# EAGLE design nixieSocket-v1 (EAGLE 5.06)
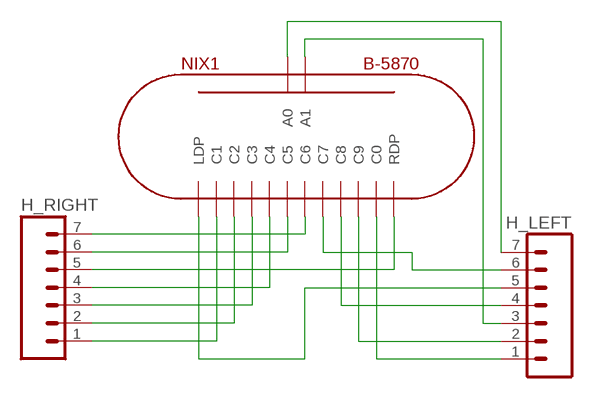
[diagram p0: schematic, sheet 1]

## Parts
H_LEFT  M07  [1X07]
H_RIGHT  M07  [1X07]
NIX1  B-5870  [B-5870]

## Nets
N$1: H_RIGHT.1 NIX1.C1
N$2: H_RIGHT.2 NIX1.C2
N$3: H_RIGHT.3 NIX1.C3
N$4: H_RIGHT.4 NIX1.C4
N$6: H_RIGHT.5 NIX1.RDP
N$7: H_RIGHT.6 NIX1.C5
N$8: H_RIGHT.7 NIX1.C6
N$9: H_LEFT.1 NIX1.C0
N$10: H_LEFT.3 NIX1.A1
N$11: H_LEFT.2 NIX1.C9
N$12: H_LEFT.4 NIX1.C8
N$13: H_LEFT.5 NIX1.LDP
N$14: H_LEFT.6 NIX1.C7
N$15: H_LEFT.7 NIX1.A0

## Library data of the parts
H_LEFT H_RIGHT = SparkFun:M07: Header 7 Standard 7-pin 0.1" header. Use with straight break away headers (SKU : PRT-00116), right angle break away headers (PRT-00553), swiss pins (PRT-00743), machine pins (PRT-00117), and female headers (PRT-00115). NOTES ON THE VARIANTS LOCK and LOCK_LONGPADS... This footprint was designed to help hold the alignment of a through-hole component (i.e. 7-pin header) while soldering it into place. You may notice that each hole has been shifted either up or down by 0.005 of an inch from it's more standard position (which is usually a perfectly straight line). This slight alteration caused the pins (the squares in the middle) to touch the edges of the holes. Because they are alternating, it causes a "brace" to hold the header in place. 0.005 has proven to be the perfect amount of "off-center" position when using our standard breakaway headers. Although looks a little odd when you look at the bare footprint, once you have a header in there, the alteration is very hard to notice. Also, if you push a header all the way into place, it is covered up entirely on the bottom side. This idea of altering the position of holes to aid alignment will be further integrated into the Sparkfun Library for other footprints. It can help hold any component with 3 or more connection pins.
NIX1 = ungood:B-5870: Burroughs 10-digit Nixie tube with left and right decimal points. B-5870S B-5870ST B-5870SF B-5870TF B-5870L

## Board
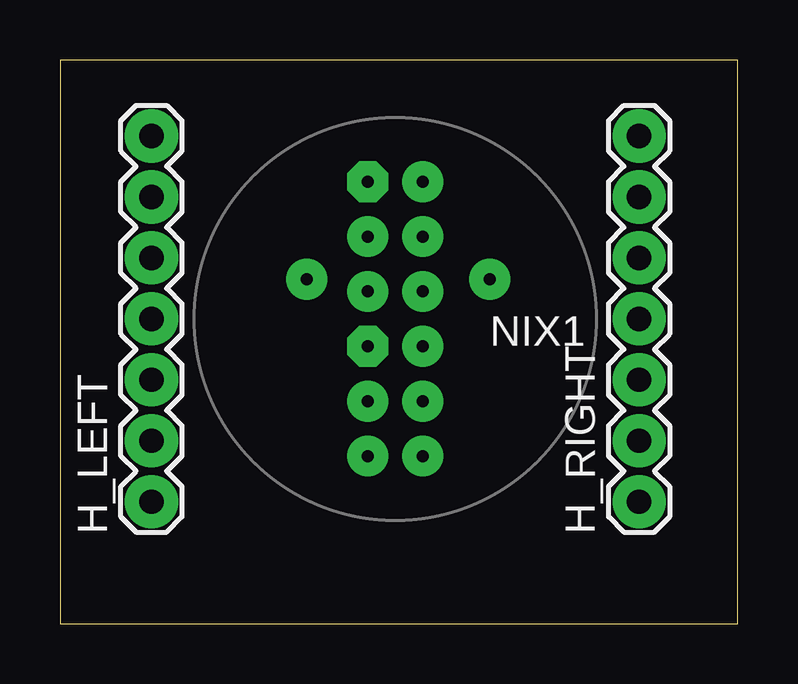
[diagram p1: board, top side]
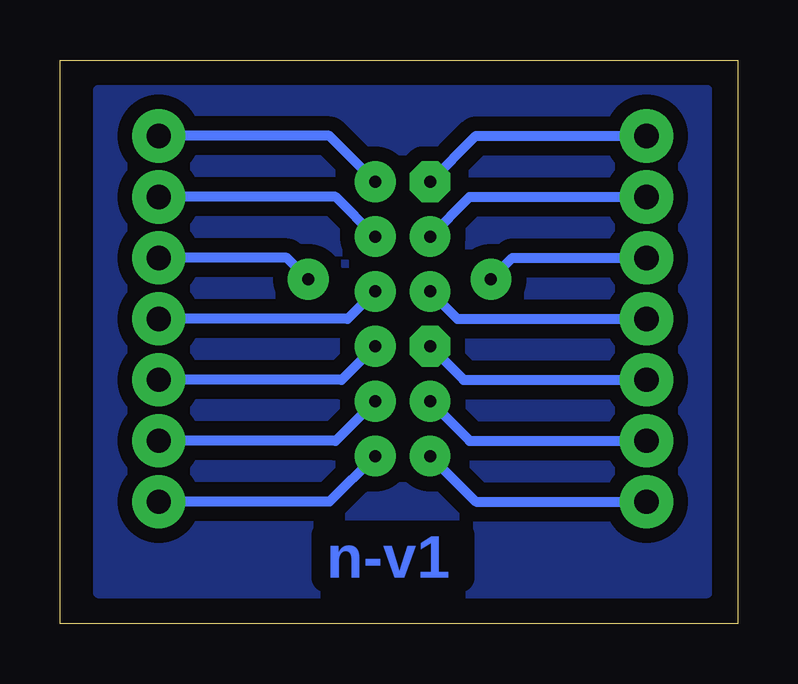
[diagram p2: board, bottom side, seen from below]

Size 28.25 x 23.48 mm. Coordinates in mm from the lower left corner, seen from the top.
Outline: 0,0 28.25,0 28.25,23.48 0,23.48 0,0
Copper layers (1*16): Top 0.035mm / dielectric 1.5mm / Bottom 0.035mm
Design rules "homebrew": minimum track width 12mil, minimum drill 25mil, track to track 12.5mil, track to pad 12.5mil, pad to pad 12.5mil, via to via 12.5mil, smd to smd 8mil, copper to edge 40mil, drill to drill 8mil, minimum pad ring 0.6mm, minimum via ring 0.6mm, stop-mask expansion 4mil, vias tented up to drill 0mil, thermal gap 10mil

### Footprints (pad centres in the part's own frame; a part is rotated, then mirrored left to right if it is on the bottom)
1X07 = drill 1.016 pad 1.88 round: 1 0,0; 2 2.54,0; 3 5.08,0; 4 7.62,0; 5 10.16,0; 6 12.7,0; 7 15.24,0
B-5870 = drill 0.5 pad 1.27 octagon: A0 -1.143,5.715; A1 -1.143,-1.143 | drill 0.5 pad 1.27 round: C0 -1.143,-5.715; C1 1.143,-5.715; C2 1.143,-3.429; C3 1.143,-1.143; C4 1.143,1.143; C5 1.143,3.429; C6 1.143,5.715; C7 -1.143,3.429; C8 -1.143,1.143; C9 -1.143,-3.429; LDP -3.683,1.651; RDP 3.937,1.651

### Placement (x,y rotation side)
H_LEFT  3.81,5.08 90 top
H_RIGHT  24.13,5.08 90 top
NIX1  13.97,12.7 0 top

### Tracks (layer width: path | path; a pad name or v marks a point on that pad's centre or on a via)
N$1
  Bottom 0.406: NIX1.C1 17.02,5.08 H_RIGHT.1
N$2
  Bottom 0.406: NIX1.C2 16.76,7.62 H_RIGHT.2
N$3
  Bottom 0.406: NIX1.C3 16.51,10.16 H_RIGHT.3
N$4
  Bottom 0.406: NIX1.C4 16.26,12.7 H_RIGHT.4
N$5
  pour Bottom (isolate 0.61): 1.27,22.23 26.67,22.23 26.67,1.27 1.27,1.27
N$6
  Bottom 0.406: NIX1.RDP 18.8,15.24 H_RIGHT.5
N$7
  Bottom 0.406: NIX1.C5 16.76,17.78 H_RIGHT.6
N$8
  Bottom 0.406: NIX1.C6 17.02,20.32 H_RIGHT.7
N$9
  Bottom 0.406: NIX1.C0 10.92,5.08 H_LEFT.1
N$10
  Bottom 0.406: NIX1.A1 11.43,10.16 H_LEFT.3
N$11
  Bottom 0.406: NIX1.C9 11.18,7.62 H_LEFT.2
N$12
  Bottom 0.406: NIX1.C8 11.68,12.7 H_LEFT.4
N$13
  Bottom 0.406: NIX1.LDP 9.4,15.24 H_LEFT.5
N$14
  Bottom 0.406: NIX1.C7 11.18,17.78 H_LEFT.6
N$15
  Bottom 0.406: NIX1.A0 10.92,20.32 H_LEFT.7

### Text on the board
Bottom: n-v1